# EAGLE schematic pyControl_breakout_1_2r1 (EAGLE 6.6.0)
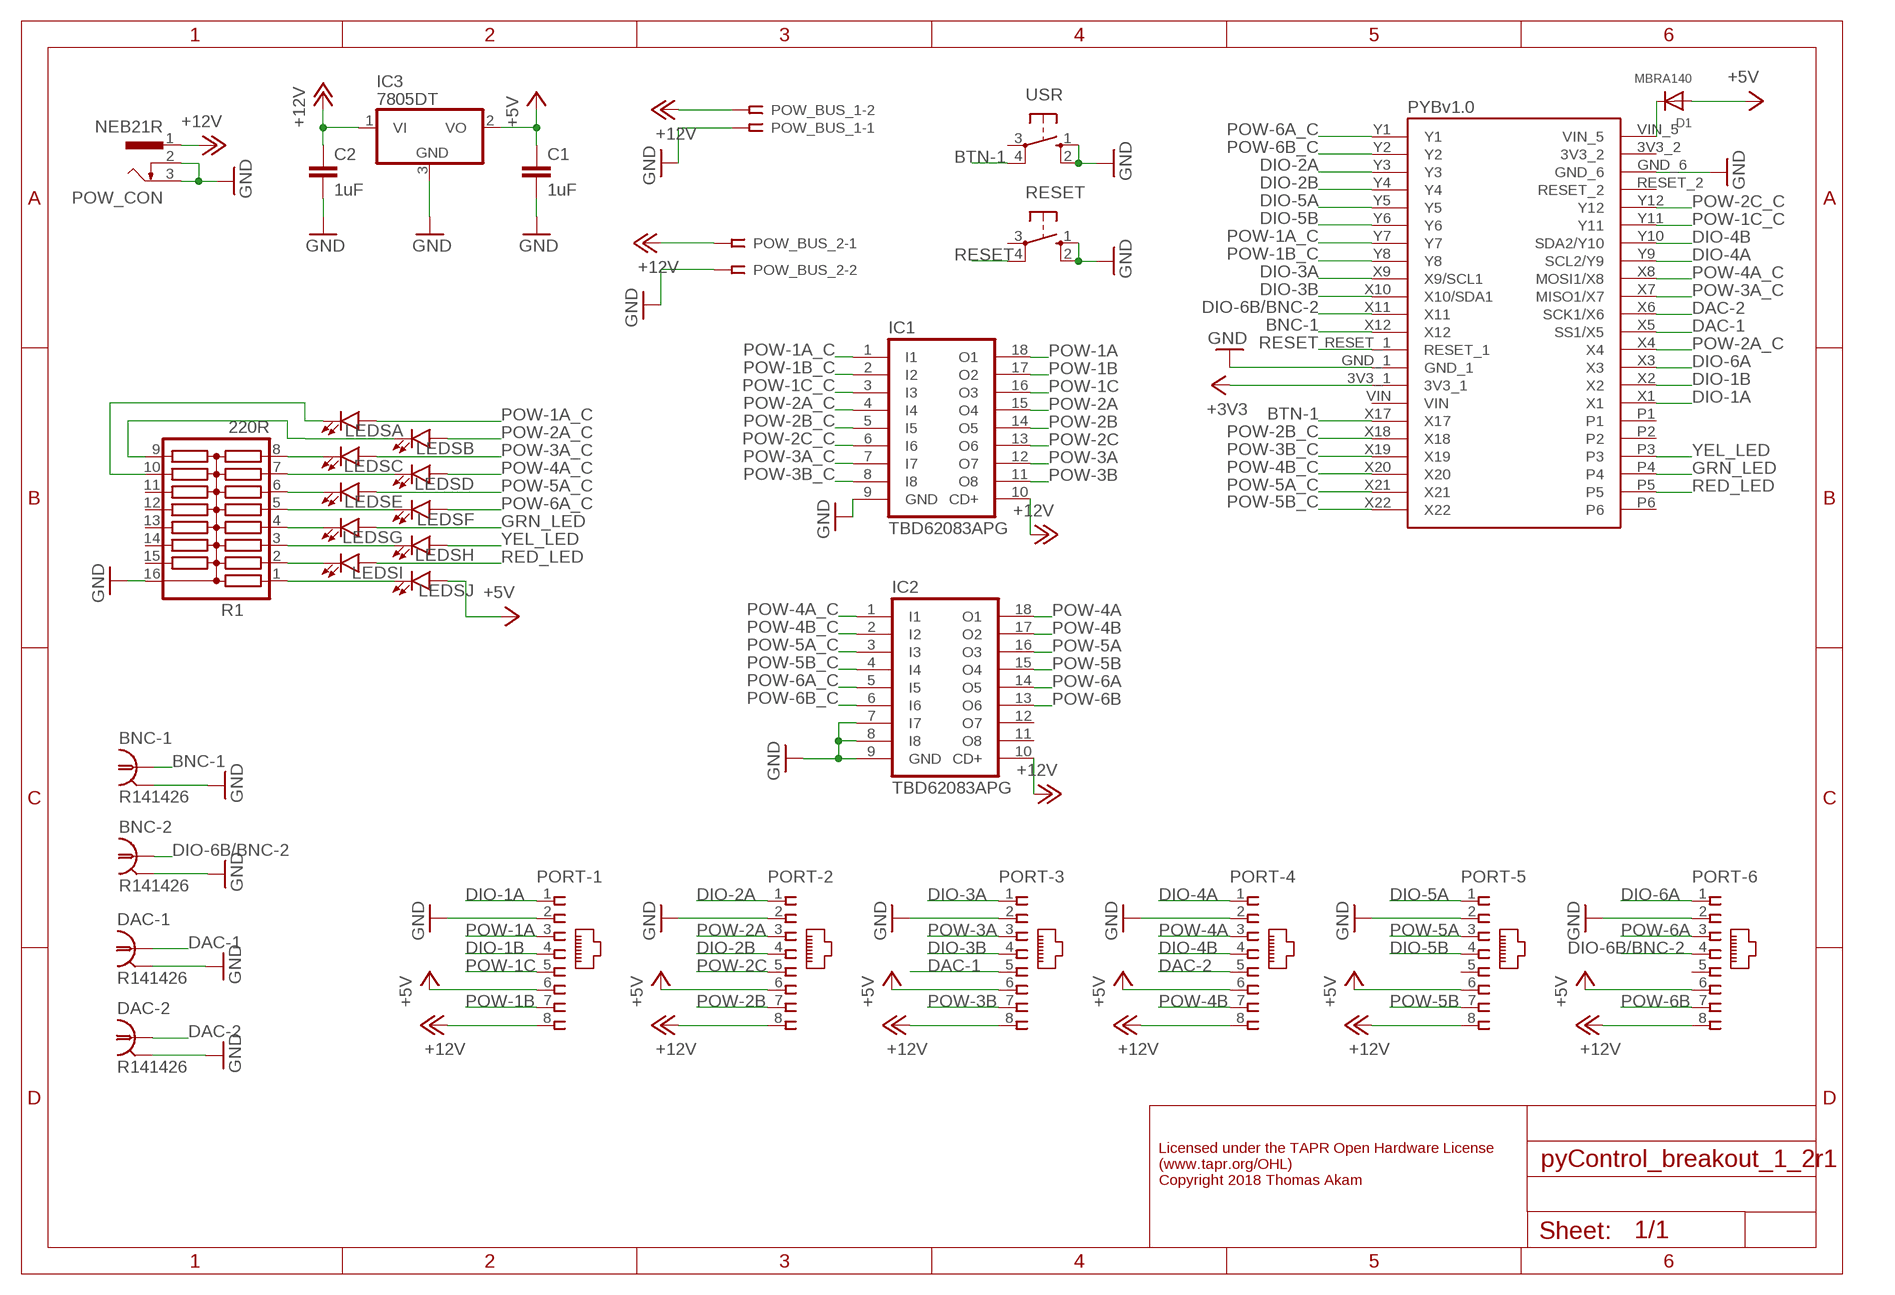
[diagram p0: schematic, sheet 1]

## Parts
BNC-1  R141426  [R141426]
BNC-2  R141426  [R141426]
C1  1uF  C-EUC1206  [C1206]
C2  1uF  C-EUC1206  [C1206]
D1  MBRA140  DIODESOD-123  [SOD-123]
DAC-1  R141426  [R141426]
DAC-2  R141426  [R141426]
IC1  TBD62083APG  ULN2803A  [DIL18]
IC2  TBD62083APG  ULN2803A  [DIL18]
IC3  7805DT  [TO252]
LEDS  LED_BARGRAPH_10  [LED_BARGAPH_10]
PORT-1  RJ45VERTICAL  [RJ45-NO-SHIELD-VERTICAL]
PORT-2  RJ45VERTICAL  [RJ45-NO-SHIELD-VERTICAL]
PORT-3  RJ45VERTICAL  [RJ45-NO-SHIELD-VERTICAL]
PORT-4  RJ45VERTICAL  [RJ45-NO-SHIELD-VERTICAL]
PORT-5  RJ45VERTICAL  [RJ45-NO-SHIELD-VERTICAL]
PORT-6  RJ45VERTICAL  [RJ45-NO-SHIELD-VERTICAL]
POW_BUS_1  SSW-102-02-S-S-RA  [SSW-102-02-S-S-RA]
POW_BUS_2  SSW-102-02-S-S-RA  [SSW-102-02-S-S-RA]
POW_CON  NEB21R  [NEB21R]
PYBOARD  PYBOARD-REDUCED-2  [PYBOARD-REDUCED-2]
R1  220R  2NBS16-15  [SO16]
RESET  40-XX  [B3F-40XX]
USR  40-XX  [B3F-40XX]

## Nets
+3V3: PYBOARD.3V3_1
+5V: C1.1 D1.A IC3.2(VO) LEDS.10(J:A) PORT-1.6 PORT-2.6 PORT-3.6 PORT-4.6 PORT-5.6 PORT-6.6
+12V: C2.1 IC1.10(CD+) IC2.10(CD+) IC3.1(VI) PORT-1.8 PORT-2.8 PORT-3.8 PORT-4.8 PORT-5.8 PORT-6.8 POW_BUS_1.2 POW_BUS_2.1 POW_CON.1
BNC-1: BNC-1.1 PYBOARD.X12
BTN-1: PYBOARD.X17 USR.4(P1)
DAC-1: DAC-1.1 PORT-3.5 PYBOARD.X5(SS1/X5)
DAC-2: DAC-2.1 PORT-4.5 PYBOARD.X6(SCK1/X6)
DIO-1A: PORT-1.1 PYBOARD.X1
DIO-1B: PORT-1.4 PYBOARD.X2
DIO-2A: PORT-2.1 PYBOARD.Y3
DIO-2B: PORT-2.4 PYBOARD.Y4
DIO-3A: PORT-3.1 PYBOARD.X9(X9/SCL1)
DIO-3B: PORT-3.4 PYBOARD.X10(X10/SDA1)
DIO-4A: PORT-4.1 PYBOARD.Y9(SCL2/Y9)
DIO-4B: PORT-4.4 PYBOARD.Y10(SDA2/Y10)
DIO-5A: PORT-5.1 PYBOARD.Y5
DIO-5B: PORT-5.4 PYBOARD.Y6
DIO-6A: PORT-6.1 PYBOARD.X3
DIO-6B/BNC-2: BNC-2.1 PORT-6.4 PYBOARD.X11
GND: BNC-1.2(GND) BNC-2.2(GND) C1.2 C2.2 DAC-1.2(GND) DAC-2.2(GND) IC1.9(GND) IC2.7(I7) IC2.8(I8) IC2.9(GND) IC3.3(GND) PORT-1.2 PORT-2.2 PORT-3.2 PORT-4.2 PORT-5.2 PORT-6.2 POW_BUS_1.1 POW_BUS_2.2 POW_CON.2 POW_CON.3 PYBOARD.GND_1 PYBOARD.GND_6 R1.16 RESET.1(S) RESET.2(S1) USR.1(S) USR.2(S1)
GRN_LED: LEDS.7(G:A) PYBOARD.P4
N$1: LEDS.12(I:C) R1.2
N$6: LEDS.19(B:C) R1.9
N$7: LEDS.18(C:C) R1.8
N$8: LEDS.17(D:C) R1.7
N$9: LEDS.16(E:C) R1.6
N$10: LEDS.15(F:C) R1.5
N$11: LEDS.14(G:C) R1.4
N$12: LEDS.13(H:C) R1.3
N$13: LEDS.20(A:C) R1.10
N$14: LEDS.11(J:C) R1.1
N$15: D1.C PYBOARD.VIN_5
POW-1A: IC1.18(O1) PORT-1.3
POW-1A_C: IC1.1(I1) LEDS.1(A:A) PYBOARD.Y7
POW-1B: IC1.17(O2) PORT-1.7
POW-1B_C: IC1.2(I2) PYBOARD.Y8
POW-1C: IC1.16(O3) PORT-1.5
POW-1C_C: IC1.3(I3) PYBOARD.Y11
POW-2A: IC1.15(O4) PORT-2.3
POW-2A_C: IC1.4(I4) LEDS.2(B:A) PYBOARD.X4
POW-2B: IC1.14(O5) PORT-2.7
POW-2B_C: IC1.5(I5) PYBOARD.X18
POW-2C: IC1.13(O6) PORT-2.5
POW-2C_C: IC1.6(I6) PYBOARD.Y12
POW-3A: IC1.12(O7) PORT-3.3
POW-3A_C: IC1.7(I7) LEDS.3(C:A) PYBOARD.X7(MISO1/X7)
POW-3B: IC1.11(O8) PORT-3.7
POW-3B_C: IC1.8(I8) PYBOARD.X19
POW-4A: IC2.18(O1) PORT-4.3
POW-4A_C: IC2.1(I1) LEDS.4(D:A) PYBOARD.X8(MOSI1/X8)
POW-4B: IC2.17(O2) PORT-4.7
POW-4B_C: IC2.2(I2) PYBOARD.X20
POW-5A: IC2.16(O3) PORT-5.3
POW-5A_C: IC2.3(I3) LEDS.5(E:A) PYBOARD.X21
POW-5B: IC2.15(O4) PORT-5.7
POW-5B_C: IC2.4(I4) PYBOARD.X22
POW-6A: IC2.14(O5) PORT-6.3
POW-6A_C: IC2.5(I5) LEDS.6(F:A) PYBOARD.Y1
POW-6B: IC2.13(O6) PORT-6.7
POW-6B_C: IC2.6(I6) PYBOARD.Y2
RED_LED: LEDS.9(I:A) PYBOARD.P5
RESET: PYBOARD.RESET_1 RESET.4(P1)
YEL_LED: LEDS.8(H:A) PYBOARD.P3
Unconnected: IC2.11(O8) IC2.12(O7) PORT-5.5 PORT-6.5 PYBOARD.3V3_2 PYBOARD.P1 PYBOARD.P2 PYBOARD.P6 PYBOARD.RESET_2 PYBOARD.VIN R1.11 R1.12 R1.13 R1.14 R1.15 RESET.3(P) USR.3(P)

## Notes on the sheet
- Licensed under the TAPR Open Hardware License
  (www.tapr.org/OHL)
  Copyright 2018 Thomas Akam

## Power pins joined to a net without a drawn wire
GND: BNC-1.3(GND) BNC-1.4(GND) BNC-1.5(GND) BNC-2.3(GND) BNC-2.4(GND) BNC-2.5(GND) DAC-1.3(GND) DAC-1.4(GND) DAC-1.5(GND) DAC-2.3(GND) DAC-2.4(GND) DAC-2.5(GND)

## Library data of the parts
BNC-1 BNC-2 DAC-1 DAC-2 = con-coax:R141426: BNC COAX CONNECTOR Radiall 50/75 Ohm Spoerle; MF: FARNELL; MPN: R141426161; OC_FARNELL: 4195115; OC_NEWARK: 14J7919
C1 C2 = resistor:C-EU: CAPACITOR, European symbol
D1 = adafruit:DIODE: Diode SMADIODE - SMA Surface Mount Package 20V 1A Schottky Diode Digikey: 641-1014-6-ND DO-1N4148 - Through Hole Small Current Diode SOD-123 20V 1 A (.5mV Vf) Schottky Diode - Digikey: MBRX120TPMSCT-ND SOD-323 10V 570mA (.38mV Vf, 3ns) Schottky Diode - Digikey: ZLLS410CT-ND SOD-523 30V 30mA Schottky Diode (RB751S-40TE61) - Digikey: RB751S-40TE61CT-ND SOT23-R/W - SOT23 Package (R = Solder Paste/Reflow Ovens, W = Hand-Soldering) BAT54Film 40V 300mA - Digikey: 497-7162-1-ND
IC1 IC2 = uln-udn:ULN2803A: DRIVER ARRAY
IC3 = linear:78*: Positive VOLTAGE REGULATOR Source: http://cache.national.com/ds/LM/LM78L05.pdf http://www.fairchildsemi.com/ds/LM/LM7805.pdf
LEDS = SparkFun-LED:LED_BARGRAPH_10: 10-Segment LED Bar Graph SFE part numbers: COM-09935 (red, Vf = 2.1V, Ifmax = 20mA) COM-09936 (yellow, Vf = 2.1V, Ifmax = 20mA) COM-09937 (blue, Vf = 3.4V, Ifmax = 20mA) COM-09938 (green, Vf = 3.4V, Ifmax = 20mA)
PORT-1-PORT-6 = con-tycoelectronics-vertical_RJ45:RJ45: CORCOM Modular RJ Jacks No Shield Source: www.tycoelectronics.com .. ENG_DS_1654001_1099_RJ_L_0507.pdf
POW_BUS_1 POW_BUS_2 = con-samtec:SSW-102-02-S-S: THROUGH-HOLE .025" SQ POST SOCKET Source: Samtec SSW.pdf; MPN: SSW-102-02-S-S-RA; OC_FARNELL: unknown; OC_NEWARK: 11P9352
POW_CON = con-lumberg:NEB21R: Netzgeräte-Einbaukupplung abgewinkelte Ausführung mit Öffner Source: http://www.lumberg.com/Produkte/PDFs/NEB21R.pdf; MPN: NEB 21 R; OC_FARNELL: 1217037; OC_NEWARK: 97K6458
PYBOARD = micropython:PYBOARD-REDUCED-2
R1 = resistor-bourns:2NBS16-15: BOURNS RESISTOR NETWORK; OC_FARNELL: unknown; OC_NEWARK: unknown
RESET USR = switch-omron:40-XX: OMRON SWITCH; MF: OMRON COMPONENTS USA; MPN: B3F-4000; OC_FARNELL: 176434; OC_NEWARK: 36K3105